# Altium schematic sheet Output Connector.SchDoc
size A; SheetNumber: 6; SheetTotal: 9
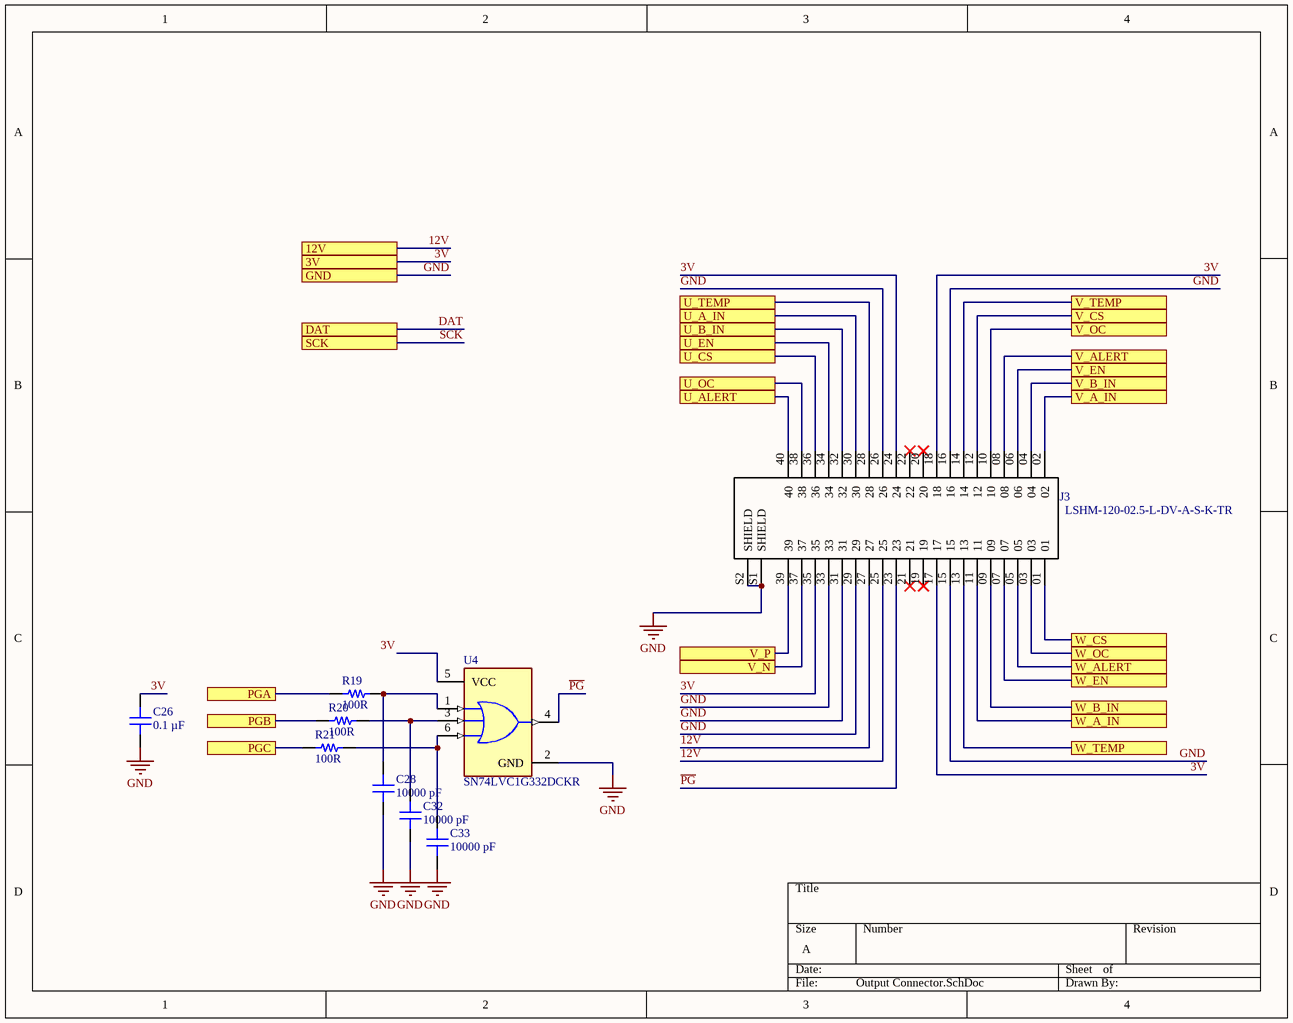
[diagram p0: Output Connector.SchDoc]

## Parts
C26  0.1 µF  [CAP 0603_1608]
C28  10000 pF  [CAP 0402_1005]
C32  10000 pF  [CAP 0402_1005]
C33  10000 pF  [CAP 0402_1005]
J3  LSHM-120-02.5-L-DV-A-S-K-TR  [*SAMTEC_LSHM-120-02.5-L-DV-A-S-K-TR_LSHM-120-02.5-L-DV-A-S-K-TR(Primary)]
R19  100R  [RES 0402_1005]
R20  100R  [RES 0402_1005]
R21  100R  [RES 0402_1005]
U4  SN74LVC1G332DCKR  [FP-DCK0006A-MFG]

## Ports
3V, 12V, DAT, GND, PGA, PGB, PGC, SCK, U_A_IN, U_ALERT, U_B_IN, U_CS, U_EN, U_OC, U_TEMP, V_A_IN, V_ALERT, V_B_IN, V_CS, V_EN, V_N, V_OC, V_P, V_TEMP, W_A_IN, W_ALERT, W_B_IN, W_CS, W_EN, W_OC, W_TEMP

## Nets
GND: C26.1 C28.1 C32.1 C33.1 J3.15 J3.16 J3.26 J3.29 J3.31 J3.33 J3.S1(SHIELD) J3.S2(SHIELD) U4.2(GND) ; port GND
3V: C26.2 J3.17 J3.18 J3.24 J3.35 U4.5(VCC) ; port 3V
12V: J3.25 J3.27 ; port 12V
DAT: port DAT
~{PG}: J3.23 U4.4(Y)
PGA: R19.1 ; port PGA
PGB: R20.1 ; port PGB
PGC: R21.1 ; port PGC
SCK: port SCK
U_A_IN: J3.30 ; port U_A_IN
U_ALERT: J3.40 ; port U_ALERT
U_B_IN: J3.32 ; port U_B_IN
U_CS: J3.36 ; port U_CS
U_EN: J3.34 ; port U_EN
U_OC: J3.38 ; port U_OC
U_TEMP: J3.28 ; port U_TEMP
V_A_IN: J3.02 ; port V_A_IN
V_ALERT: J3.08 ; port V_ALERT
V_B_IN: J3.04 ; port V_B_IN
V_CS: J3.12 ; port V_CS
V_EN: J3.06 ; port V_EN
V_N: J3.37 ; port V_N
V_OC: J3.10 ; port V_OC
V_P: J3.39 ; port V_P
V_TEMP: J3.14 ; port V_TEMP
W_A_IN: J3.11 ; port W_A_IN
W_ALERT: J3.05 ; port W_ALERT
W_B_IN: J3.09 ; port W_B_IN
W_CS: J3.01 ; port W_CS
W_EN: J3.07 ; port W_EN
W_OC: J3.03 ; port W_OC
W_TEMP: J3.13 ; port W_TEMP
NetC28_2: C28.2 R19.2 U4.1(A)
NetC32_2: C32.2 R20.2 U4.3(B)
NetC33_2: C33.2 R21.2 U4.6(C)

Not connected (* = marked no-connect by the designer): J3 19* 20* 21* 22*

## Library data of the parts
C26 = C0603C104K5RAC7411: CAP CER 0.1UF 50V X7R 0603; manufacturer: KEMET; Tolerance: ±10%; Part Number: C0603C104K5RAC7411; Capacitance: 0.1 µF; Applications: Bypass, Decoupling; componentlink1description: Datasheet; componentlink1url: https://api.kemet.com/component-edge/download/datasheet/C0603C104K5RAC7411.pdf; componentlink2description: DigiKey Link; componentlink2url: https://www.digikey.com/en/products/detail/kemet/C0603C104K5RAC7411/3317013; Device Package: 0603 (1608 Metric); lastupdated: 2/9/2024 8:10:30 PM; Lifecycle Status: Active; Minimum Order: 1; Mounting Type: Surface Mount, MLCC; Operating Temperature: -55°C ~ 125°C; Package / Case: 0603 (1608 Metric); packaging: TapeAndReel; partid: 2233; Part Status: Active; price: 0.01; series: SMD Comm X7R; Size / Dimension: 0.063" L x 0.031" W (1.60mm x 0.80mm); Supplier 1: DigiKey; Supplier Part Number 1: 399-C0603C104K5RAC7411CT-ND; Temperature Coefficient: X7R; Thickness (Max): 0.035" (0.90mm); value: 0.1 µF; Voltage - Rated: 50V
C28 C32 C33 = C0402C103K4RECAUTO: CAP CER 10000PF 16V X7R 0402; manufacturer: KEMET; Tolerance: ±10%; Part Number: C0402C103K4RECAUTO; Capacitance: 10000 pF; Applications: Automotive, ESD Protection; componentlink1description: Datasheet; componentlink1url: https://api.kemet.com/component-edge/download/datasheet/C0402C103K4RECAUTO.pdf; componentlink2description: DigiKey Link; componentlink2url: https://www.digikey.com/en/products/detail/kemet/C0402C103K4RECAUTO/8640470; Device Package: 0402 (1005 Metric); lastupdated: 2/9/2024 8:04:38 PM; Lifecycle Status: Active; Minimum Order: 1; Mounting Type: Surface Mount, MLCC; Operating Temperature: -55°C ~ 125°C; Package / Case: 0402 (1005 Metric); packaging: TapeAndReel; partid: 1725; Part Status: Active; price: 0.01; Ratings: AEC-Q200; series: ESD SMD Auto X7R; Size / Dimension: 0.039" L x 0.020" W (1.00mm x 0.50mm); Supplier 1: DigiKey; Supplier Part Number 1: 399-17876-1-ND; Temperature Coefficient: X7R; Thickness (Max): 0.022" (0.55mm); value: 10000 pF; Voltage - Rated: 16V
R19-R21 = RP73PF1E249KBTD: RES 249K OHM 0.1% 1/10W 0402; Manufacturer: TE Connectivity Passive Product; Value: 249 kOhms; Power (Watts): 0.1W, 1/10W; Temperature Coefficient: ±25ppm/°C; Part Number: RP73PF1E249KBTD; ComponentLink1Description: Datasheet; ComponentLink1URL: https://www.te.com/commerce/DocumentDelivery/DDEController?Action=srchrtrv&DocNm=1773272&DocType=DS&DocLang=English; ComponentLink2Description: DigiKey Link; ComponentLink2URL: https://www.digikey.com/en/products/detail/te-connectivity-passive-product/RP73PF1E249KBTD/8261091; Composition: Thin Film; Device Package: 0402 (1005 Metric); Height - Seated (Max): 0.014" (0.35mm); LastUpdated: 2/9/2024 8:30:24 PM; Lifecycle Status: Active; Minimum Order: 1; Number of Terminations: 2; Operating Temperature: -55°C ~ 155°C; Package / Case: 0402 (1005 Metric); Packaging: TapeAndReel; PartId: 2418; Part Status: Active; Price: 0.07; Resistance: 249 kOhms; Series: RP73, Holsworthy; Size / Dimension: 0.039" L x 0.020" W (1.00mm x 0.50mm); Supplier 1: DigiKey; Supplier Part Number 1: A127549CT-ND; Supplier Device Package: 0402; Tolerance: ±0.1%
U4 = CMP-0859-00464-4: IC GATE OR 1CH 3-INP SC70-6; Manufacturer: Texas Instruments; Min Supply Voltage: 1.65V; Number Of Circuits: 1; Nominal Supply Current: 10uA; Number Of Inputs: 3; Max Supply Voltage: 5.5V; Propagation Delay: 20ns; Standoff Height: 0mm; Logic Function Desc: Non-Inverting; Manufacturer Part Number: SN74LVC1G332DCKR; Automotive: No; Temperature: -40°C to +125°C; Device Class L1: Integrated Circuits (ICs); ComponentLink2URL: http://www.ti.com/lit/ds/symlink/sn74lvc1g332.pdf; RoHS: TRUE; Digikey Description: IC GATE OR 1CH 3-INP SC70-6; Octopart: https://octopart.com/sn74lvc1g332dckr-texas+instruments-464861; Ambient Temperature Range Low: -40°C; Number Of Outputs: 1; Height: 1.1mm; Device Class L2: Logic ICs; Mouser Description: Logic Gates Single 3-Input Pos- OR Gate; ComponentLink2Description: Datasheet; Package: DCK0006A; Temperature Range Low: -40°C; Ambient Temperature Range High: +125°C; Temperature Range High: +125°C; Category: IC; Device Class L3: Logic Gates; Lead Free: Yes
J3 = LSHM-120-02.5-L-DV-A-S-K-TR: Value: *